# Altium schematic sheet PowerHalfBridge.SchDoc
size A3
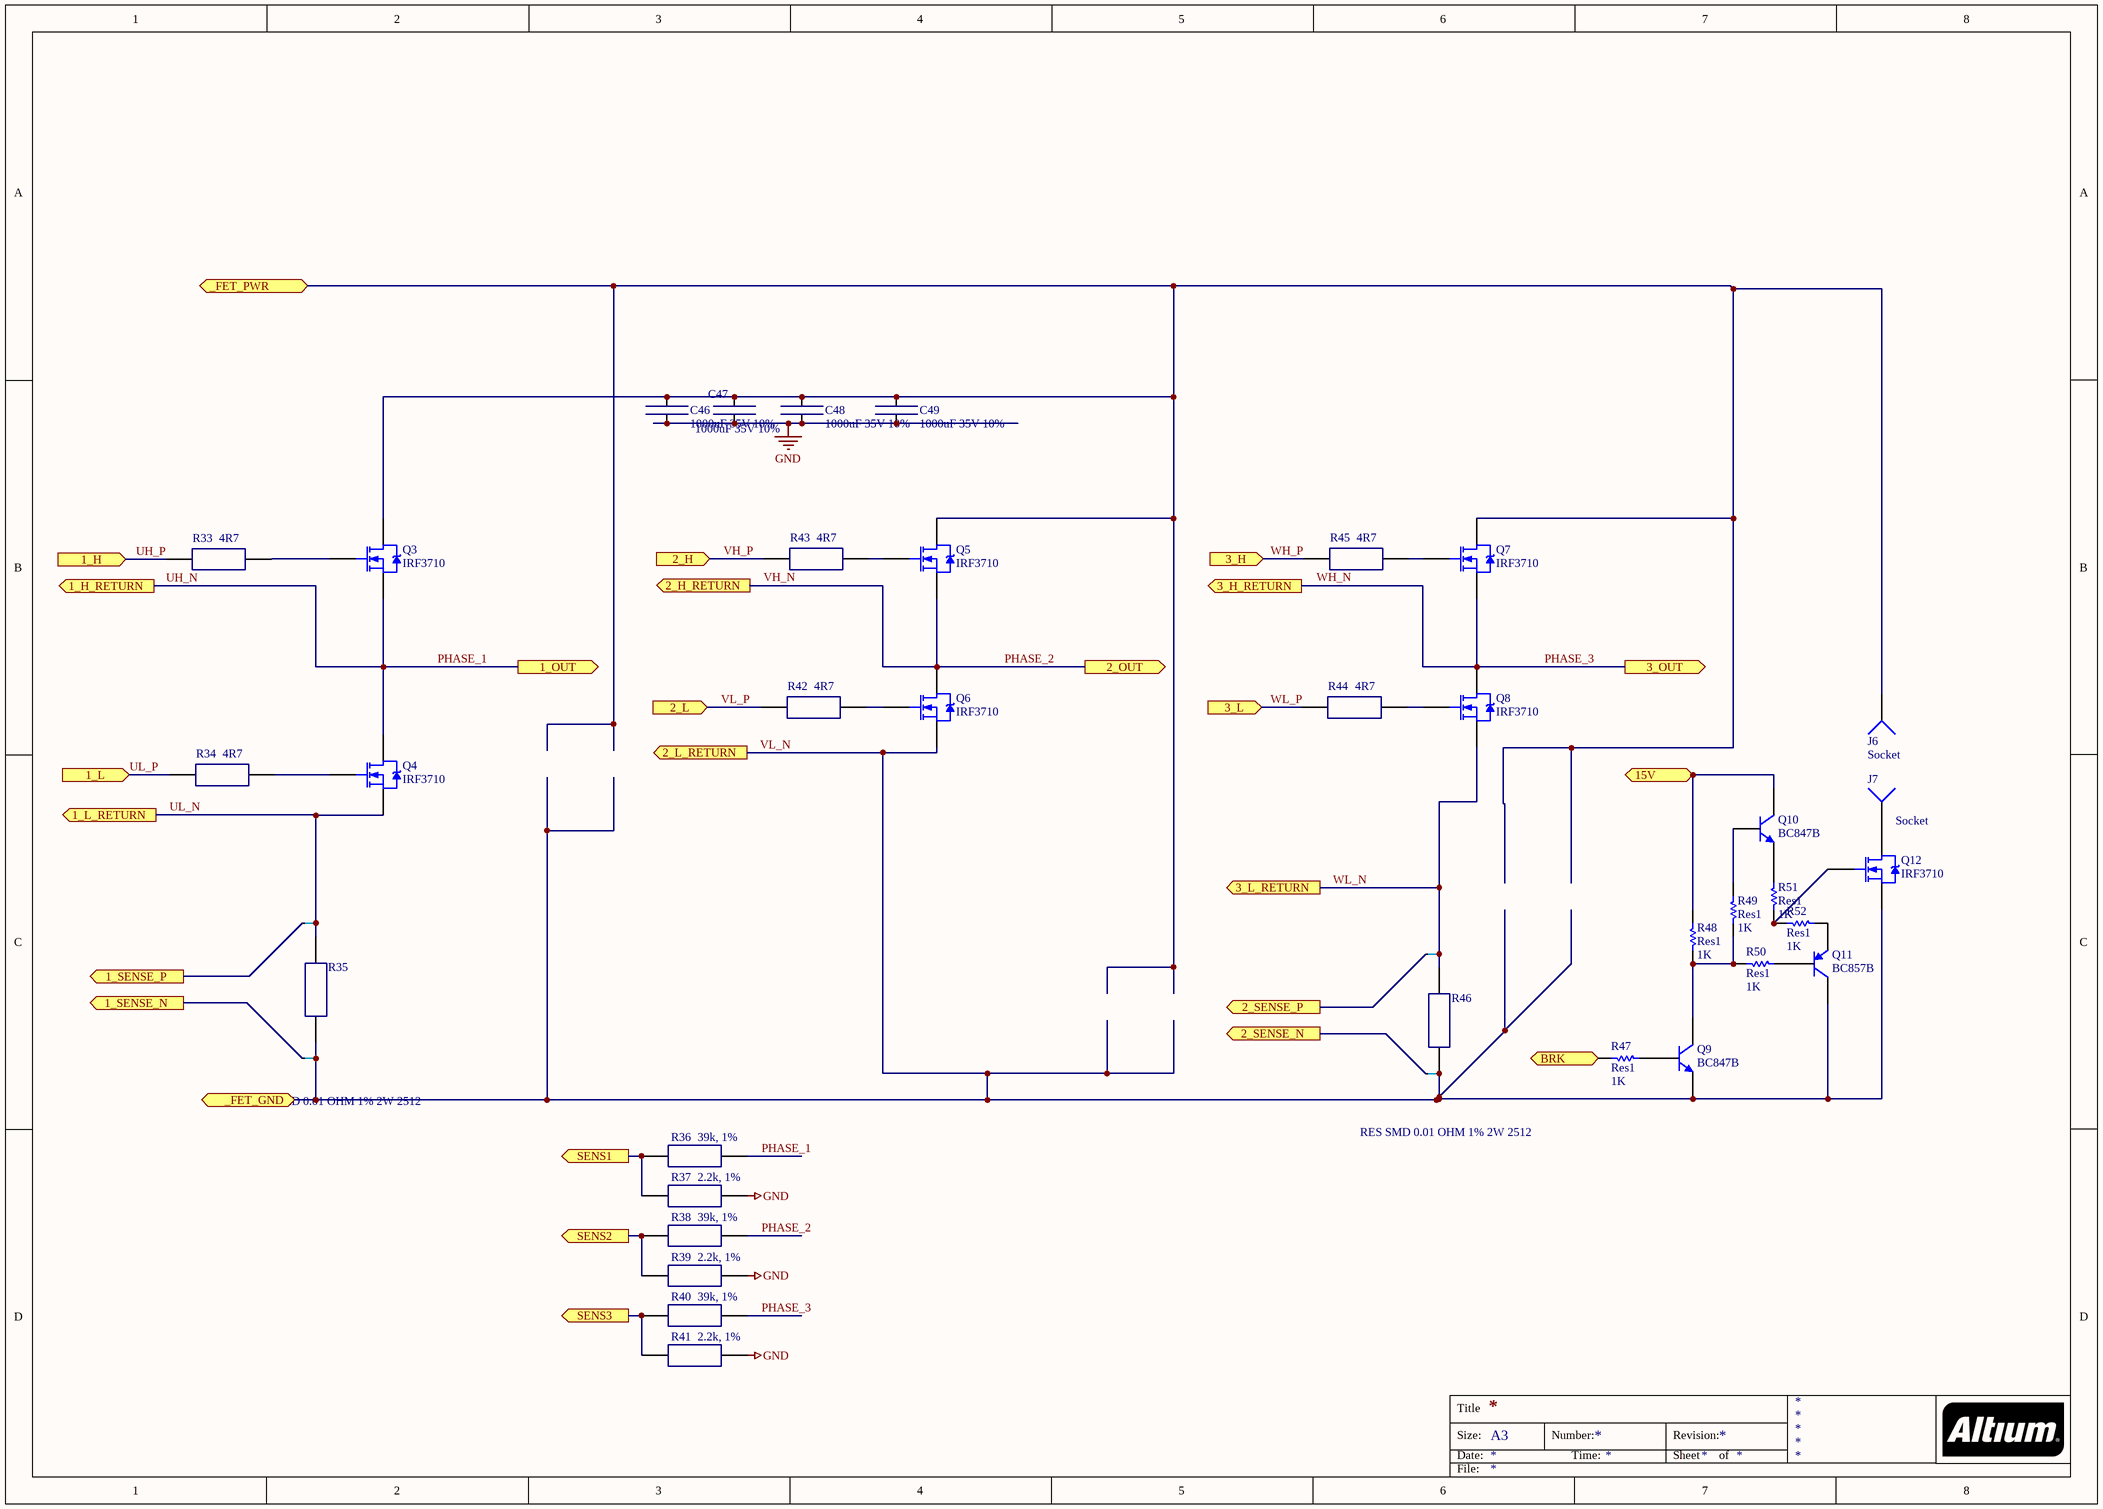
[diagram p0: PowerHalfBridge.SchDoc]

## Parts
C46  1000uF 35V 10%  [CAP_1mF_63V]
C47  1000uF 35V 10%  [CAP_1mF_63V]
C48  1000uF 35V 10%  [CAP_1mF_63V]
C49  1000uF 35V 10%  [CAP_1mF_63V]
J6  Socket  [PIN1]
J7  Socket  [PIN1]
NT2  NET_TIE  [NET_TIE_10mil]  (value not drawn)  (net tie, no BOM)
NT3  NET_TIE  [NET_TIE_10mil]  (value not drawn)  (net tie, no BOM)
NT4  NET_TIE  [NET_TIE_10mil]  (value not drawn)  (net tie, no BOM)
NT5  NET_TIE  [NET_TIE_10mil]  (value not drawn)  (net tie, no BOM)
Q3  IRF3710  [TO-220AB_LOW]
Q4  IRF3710  [TO-220AB_LOW]
Q5  IRF3710  [TO-220AB_LOW]
Q6  IRF3710  [TO-220AB_LOW]
Q7  IRF3710  [TO-220AB_LOW]
Q8  IRF3710  [TO-220AB_LOW]
Q9  BC847B  [SOT23_N]
Q10  BC847B  [SOT23_N]
Q11  BC857B  [SOT-23A_N]
Q12  IRF3710  [TO-220AB_LOW]
R33  4R7  [0603x]
R34  4R7  [RESC1608X05N(0603)]
R35  RES SMD 0.01 OHM 1% 2W 2512  [1T-2512]
R36  39k, 1%  [0805x]
R37  2.2k, 1%  [0805x]
R38  39k, 1%  [0805x]
R39  2.2k, 1%  [0805x]
R40  39k, 1%  [0805x]
R41  2.2k, 1%  [0805x]
R42  4R7  [RESC1608X05N(0603)]
R43  4R7  [RESC1608X05N(0603)]
R44  4R7  [RESC1608X05N(0603)]
R45  4R7  [RESC1608X05N(0603)]
R46  RES SMD 0.01 OHM 1% 2W 2512  [1T-2512]
R47  Res1  value 1K  [0603x]
R48  Res1  value 1K  [0603x]
R49  Res1  value 1K  [0603x]
R50  Res1  value 1K  [0603x]
R51  Res1  value 1K  [0603x]
R52  Res1  value 1K  [0603x]

## Ports
1_H (in), 1_H_RETURN (out), 1_L (in), 1_L_RETURN (out), 1_OUT (out), 1_SENSE_N (out), 1_SENSE_P (out), 2_H (in), 2_H_RETURN (out), 2_L (in), 2_L_RETURN (out), 2_OUT (out), 2_SENSE_N (out), 2_SENSE_P (out), 3_H (in), 3_H_RETURN (out), 3_L (in), 3_L_RETURN (out), 3_OUT (out), 15V, _FET_GND, _FET_PWR, BRK, SENS1 (out), SENS2 (out), SENS3 (out)

## Nets
GND: C46.1 C47.2 C48.1 C49.2 R37.2 R39.2 R41.2
1_SENSE_N: NT3.1 ; port 1_SENSE_N
1_SENSE_P: NT2.1 ; port 1_SENSE_P
2_SENSE_N: NT5.1 ; port 2_SENSE_N
2_SENSE_P: NT4.1 ; port 2_SENSE_P
15V: Q10.3(C) R48.1 ; port 15V
_FET_PWR: C46.2 C47.1 C48.2 C49.1 J6.1 Q3.2(D) Q5.2(D) Q7.2(D) ; port _FET_PWR
BRK: R47.1 ; port BRK
PHASE_1: Q3.3(S) Q4.2(D) R36.2 ; port 1_H_RETURN, port 1_OUT  [also labelled UH_N]
PHASE_2: Q5.3(S) Q6.2(D) R38.2 ; port 2_OUT, port 2_H_RETURN  [also labelled VH_N]
PHASE_3: Q7.3(S) Q8.2(D) R40.2 ; port 3_OUT, port 3_H_RETURN  [also labelled WH_N]
SENS1: R36.1 R37.1 ; port SENS1
SENS2: R38.1 R39.1 ; port SENS2
SENS3: R40.1 R41.1 ; port SENS3
UH_P: R33.1 ; port 1_H
UL_N: NT2.2 Q4.3(S) R35.1 ; port 1_L_RETURN
UL_P: R34.1 ; port 1_L
VH_P: R43.1 ; port 2_H
VL_N: NT3.2 NT5.2 Q6.3(S) Q9.2(E) Q11.3(C) Q12.3(S) R35.2 R46.2 ; port 2_L_RETURN, port _FET_GND
VL_P: R42.1 ; port 2_L
WH_P: R45.1 ; port 3_H
WL_N: NT4.2 Q8.3(S) R46.1 ; port 3_L_RETURN
WL_P: R44.1 ; port 3_L
NetJ7_1: J7.1 Q12.2(D)
NetQ3_1: Q3.1(G) R33.2
NetQ4_1: Q4.1(G) R34.2
NetQ5_1: Q5.1(G) R43.2
NetQ6_1: Q6.1(G) R42.2
NetQ7_1: Q7.1(G) R45.2
NetQ8_1: Q8.1(G) R44.2
NetQ9_1: Q9.1(B) R47.2
NetQ9_3: Q9.3(C) R48.2 R49.2 R50.1
NetQ10_1: Q10.1(B) R49.1
NetQ10_2: Q10.2(E) R51.2
NetQ11_1: Q11.1(B) R50.2
NetQ11_2: Q11.2(E) R52.2
NetQ12_1: Q12.1(G) R51.1 R52.1

## Notes on the sheet
- Title
- Size:
- Date:
- A3
- Number:
- Time:
- Revision:
- Sheet
- of
- File:

## Library data of the parts
C46-C49 = Ceramic Chip Capacitor: Value: CAP CER 0.022UF 50V X7R 0402; Order Number: GRM155R71H223KA12D; Distributor: Murata Electronics; Package: 0402
NT2-NT5 = Net tie
Q3-Q8 Q12 = IRF3710: HEXFET Power MOSFET; Note: Pin 2 is electrically connected to pin 4.; Sim Note: Thermal Model provided is not called on from main Subckt.; Published: 8-Jun-2000; LatestRevisionDate: 17-Jul-2002; LatestRevisionNote: Re-released for DXP Platform.; DatasheetVersion: May-1998; PackageVersion: Feb-1997; PackageReference: TO-220AB; Publisher: Altium Limited; PackageDescription: TO, Thru-Hole, Vertical, Heatsink Mounted; 3 In-Line Leads; Pitch 2.54 mm; ComponentLink1Description: Manufacturer Link; ComponentLink1URL: http://www.irf.com/; ComponentLink2Description: Datasheet; ComponentLink2URL: http://www.irf.com/product-info/datasheets/data/irf3710.pdf
Q9 Q10 = BC847B: NPN General-purpose Transistor; Published: 17-Sep-2003; LatestRevisionDate: 12-Dec-2006; LatestRevisionNote: IPC-7351 Footprint Added.; DatasheetVersion: 4-Feb-2002; PackageVersion: May-1999; PackageReference: SOT23; Publisher: Altium Limited; PackageDescription: 3-Pin SOT-23 Package 0.95 mm Pitch, 2.3 mm Lead Span; ComponentLink1Description: Manufacturer Link; ComponentLink1URL: http://www.semiconductors.philips.com/; ComponentLink2Description: Datasheet; ComponentLink2URL: http://www.semiconductors.philips.com/acrobat/datasheets/BC846_BC847_BC848_5.pdf
Q11 = BC857B: PNP General Purpose Amplifier; Published: 8-Jun-2000; LatestRevisionDate: 20-Nov-2009; LatestRevisionNote: IPC-7351 Footprint Added.; DatasheetVersion: 1997; PackageVersion: Sep-1998; PackageReference: SOT-23A; Publisher: Altium Limited; PackageDescription: 3-Pin SOT-23 Package 0.95 mm Pitch, 2.3 mm Lead Span; ComponentLink1Description: Manufacturer Link; ComponentLink1URL: http://www.fairchildsemi.com/; ComponentLink2Description: Datasheet; ComponentLink2URL: http://www.fairchildsemi.com/ds/BC%2FBC857.pdf
R33 R34 R42-R45 = SMD: Value: RES SMD 4.7 OHM 5% 1/10W 0603; Order Number: ERJ-3GEYJ4R7V; Distributor: Panasonic
  R33 R34 R42 R44 R45: Package: RESC1608X05N(0603)
  R43: Package: 0603
R35 R46 = SMD: Order Number: WSL2512R0100FEA; Value: RES SMD 0.01 OHM 1% 2W 2512; Package: 2512; Distributor: Vishay Dale
R36 R38 R40 = SMD: Order Number: ERJ-3EKF3902V; Value: 39k, 1%; Package: RESC1608X05N(0603); Distributor: Panasonic
R37 R39 R41 = SMD: Order Number: ERJ-3EKF2201V; Value: 2.2k, 1%; Package: RESC1608X05N(0603); Distributor: Panasonic
R47-R52 = Res1: Resistor; Published: 8-Jun-2000; LatestRevisionDate: 17-Jul-2002; LatestRevisionNote: Re-released for DXP Platform.; PackageReference: AXIAL-0.3; Publisher: Altium Limited; PackageDescription: Axial Device, Thru-Hole; 2 Leads; 0.3 in Pin Spacing
J6 J7 = Socket: LatestRevisionDate: 17-Jul-2002; LatestRevisionNote: Re-released for DXP Platform.; Publisher: Altium Limited